# Altium schematic sheet Main_Board.SchDoc
size A2
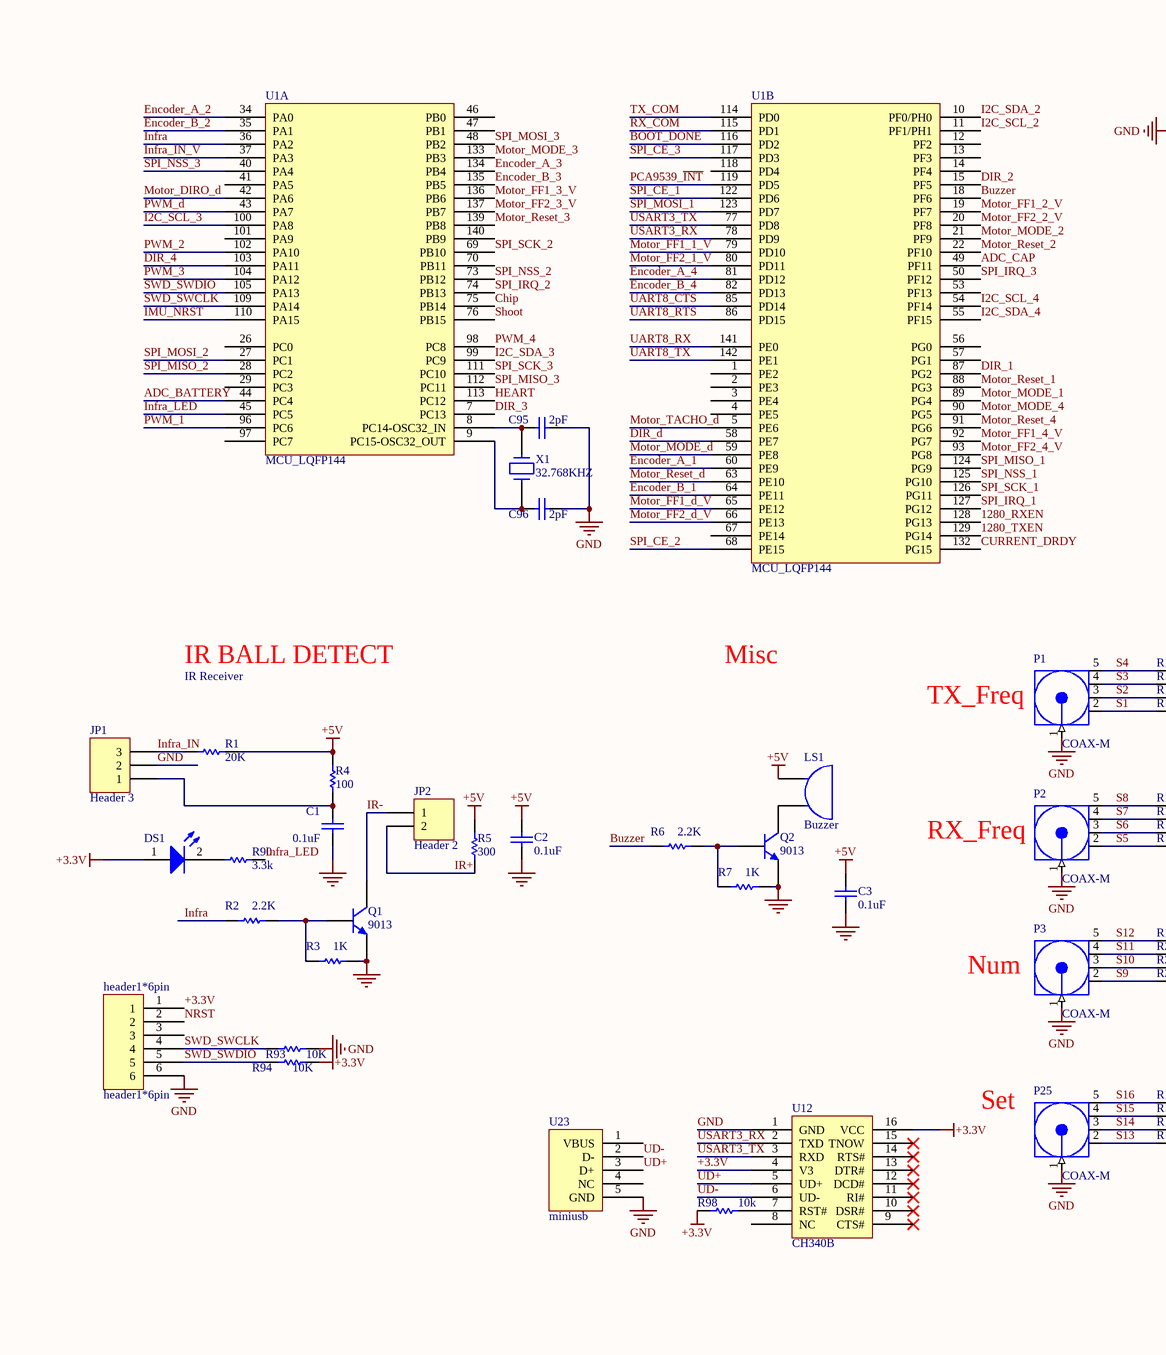
[diagram p0: Main_Board.SchDoc, left]
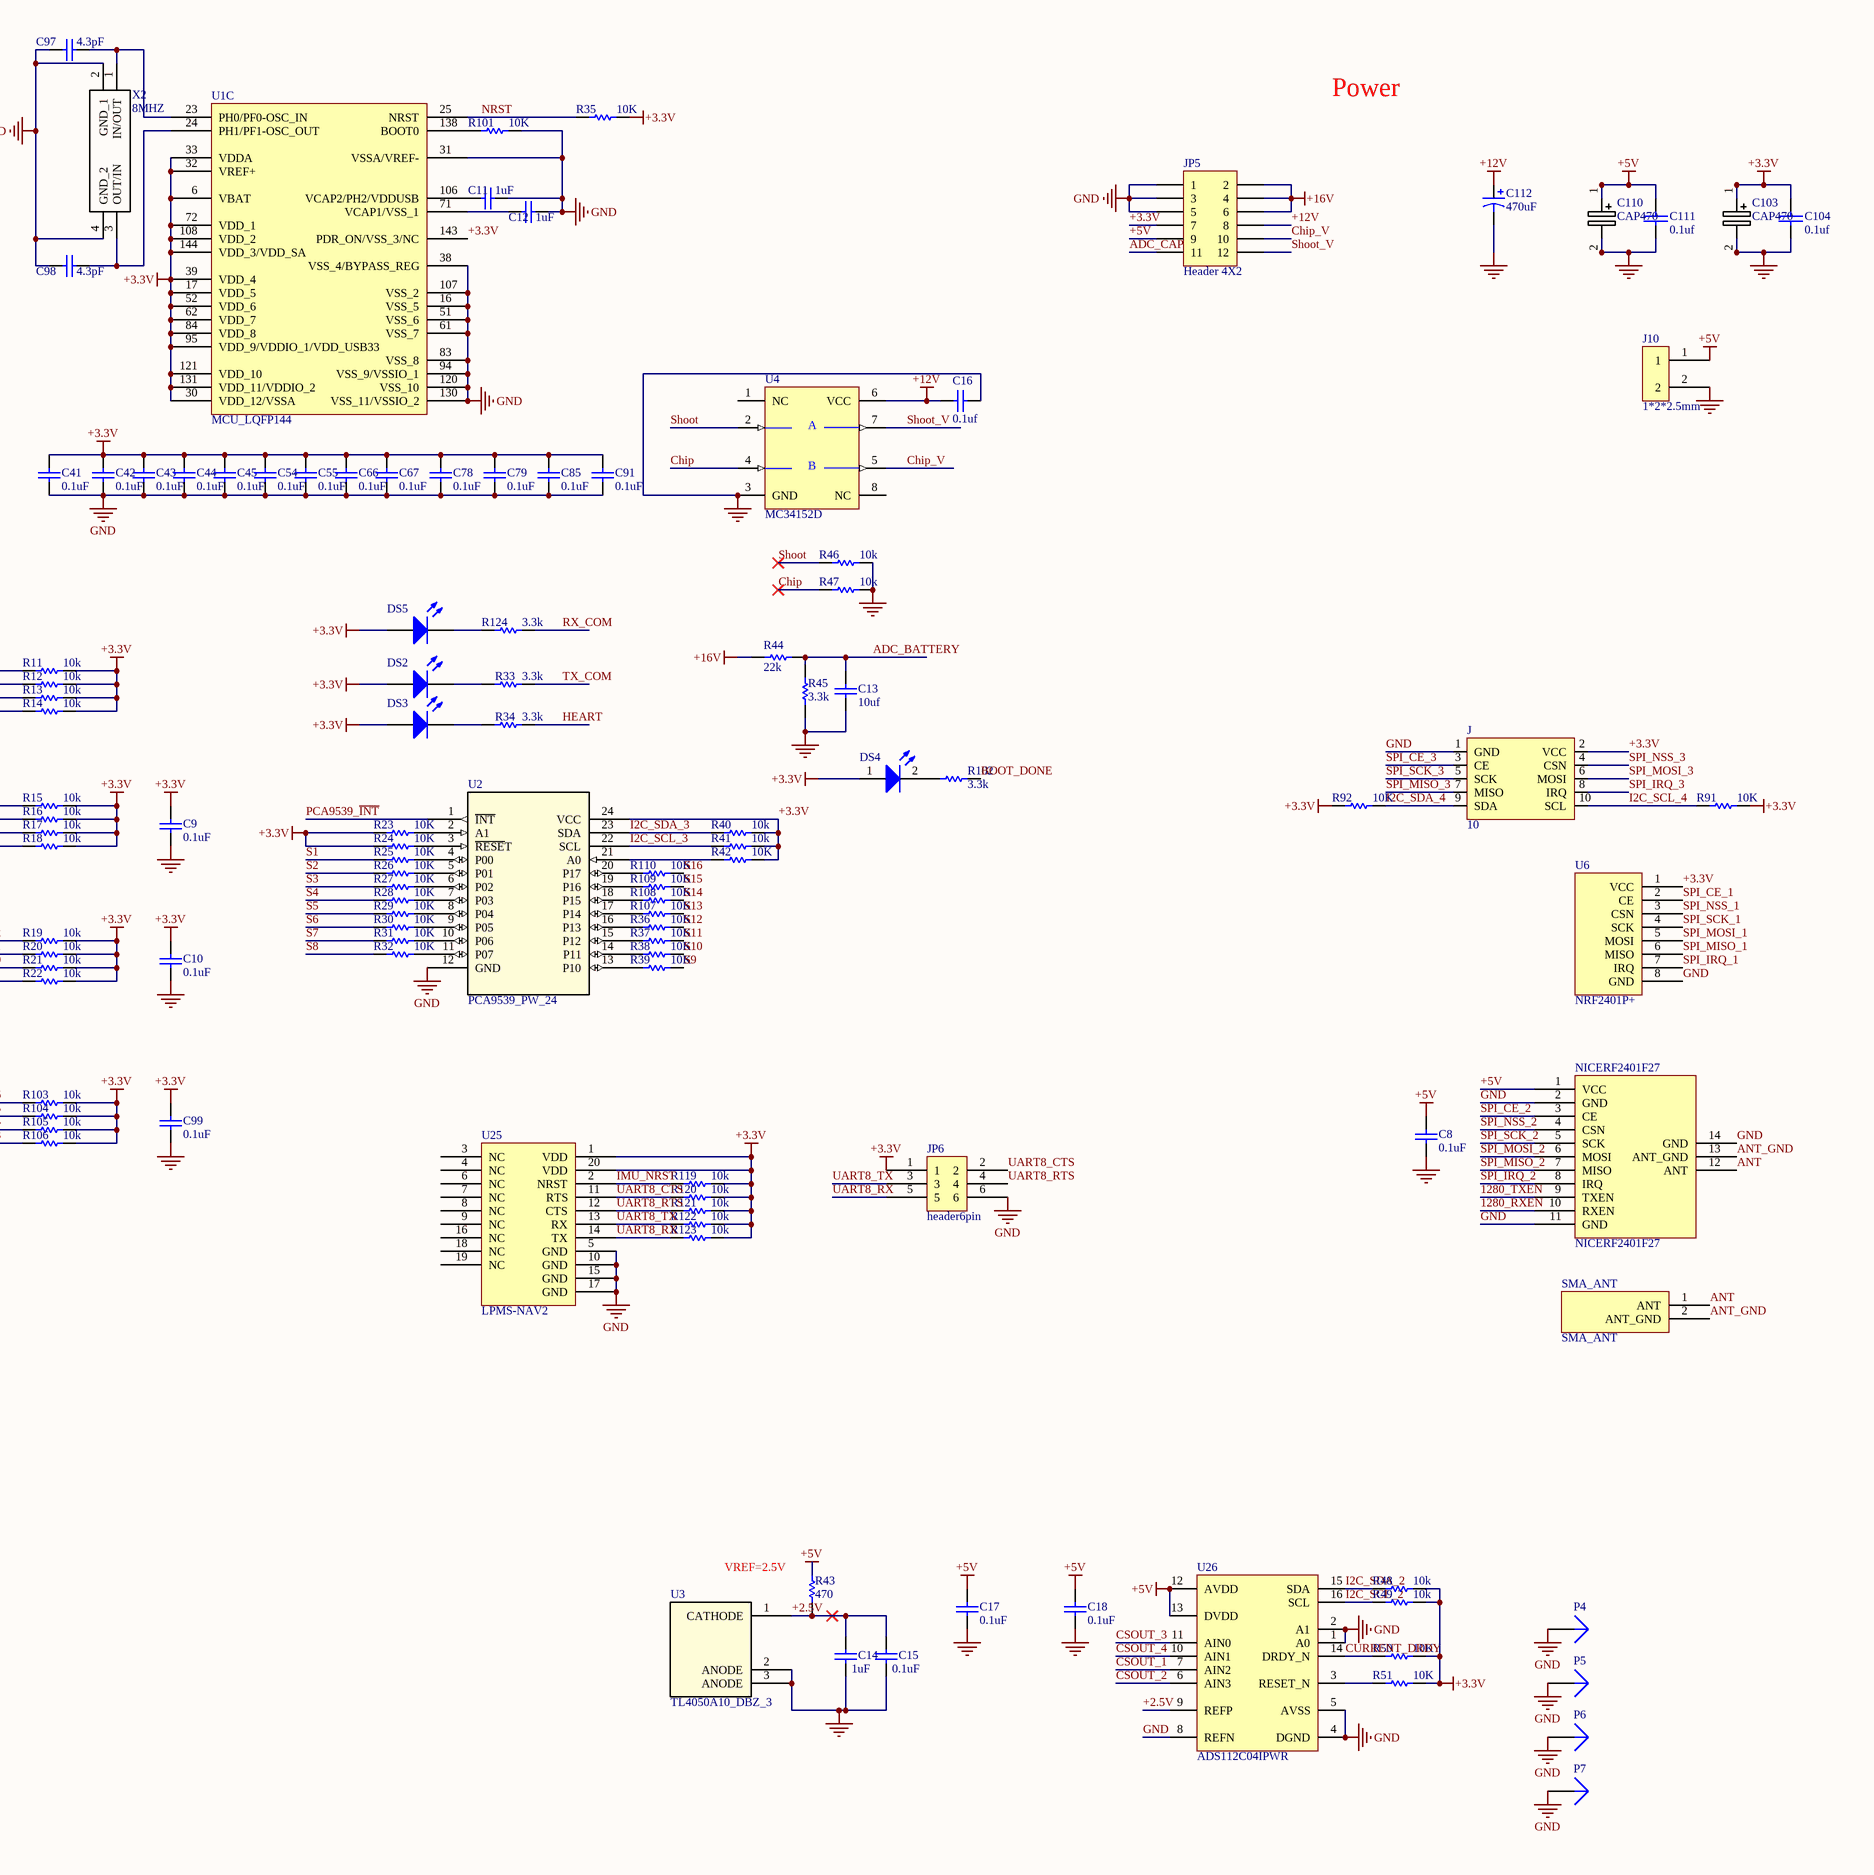
[diagram p1: Main_Board.SchDoc, right]

## Parts
C1  0.1uf  [0805C]
C2  0.1uf  [0805C]
C3  0.1uf  [0805C]
C8  0.1uF  [0805C]
C9  0.1uf  [0805C]
C10  0.1uf  [0805C]
C11  1uf  [0805C]
C12  1uf  [0805C]
C13  10uf  [0805C]
C14  1uf  [0805C]
C15  0.1uf  [0805C]
C16  0.1uf  [0805C]
C17  0.1uf  [0805C]
C18  0.1uf  [0805C]
C41  0.1uF  [0805C]
C42  0.1uf  [0805C]
C43  0.1uf  [0805C]
C44  0.1uf  [0805C]
C45  0.1uf  [0805C]
C54  0.1uf  [0805C]
C55  0.1uf  [0805C]
C66  0.1uf  [0805C]
C67  0.1uf  [0805C]
C78  0.1uf  [0805C]
C79  0.1uf  [0805C]
C85  0.1uf  [0805C]
C91  0.1uf  [0805C]
C95  2pf  [0805C]
C96  2pf  [0805C]
C97  4.3pf  [0805C]
C98  4.3pf  [0805C]
C99  0.1uF  [0805C]
C103  CAP470  [CAPPM7360X200N]
C104  0.1uf  [0805C]
C110  CAP470  [CAPPM7360X200N]
C111  0.1uf  [0805C]
C112  470uF  [470uF]
DS1  LED2  [0805D]  (value not drawn)
DS2  LED1  [0805D]  (value not drawn)
DS3  LED2  [0805D]  (value not drawn)
DS4  LED2  [0805D]  (value not drawn)
DS5  LED1  [0805D]  (value not drawn)
header1*6pin  header1*6pin  [1*6_2.5mm]
J  10  [10]
J10  1*2*2.5mm  [1*2_2.5mm]
JP1  Header 3  [SHDR3]
JP2  Header 2  [SHDR2]
JP5  Header 4X2  [2*6_2.5mm]
JP6  header6pin  [2*3_2.5mm]
LS1  Buzzer  [Buzzer]
NICERF2401F27  NICERF2401F27  [NICERF2401F27]
P1  COAX-M  [A6RV-161RS]
P2  COAX-M  [A6RV-161RS]
P3  COAX-M  [A6RV-161RS]
P4  安装孔  [安装孔-3.5-5]  (value not drawn)
P5  安装孔  [安装孔-3.5-5]  (value not drawn)
P6  安装孔  [安装孔-3.5-5]  (value not drawn)
P7  安装孔  [安装孔-3.5-5]  (value not drawn)
P25  COAX-M  [A6RV-161RS]
Q1  9013  [SO-G3/Y1]
Q2  9013  [SO-G3/Y1]
R1  20k  [0805R]
R2  2.2k  [0805R]
R3  1k  [0805R]
R4  100  [0805R]
R5  300  [0805R]
R6  2.2k  [0805R]
R7  1k  [0805R]
R11  10k  [0805R]
R12  10k  [0805R]
R13  10k  [0805R]
R14  10k  [0805R]
R15  10k  [0805R]
R16  10k  [0805R]
R17  10k  [0805R]
R18  10k  [0805R]
R19  10k  [0805R]
R20  10k  [0805R]
R21  10k  [0805R]
R22  10k  [0805R]
R23  10k  [0805R]
R24  10k  [0805R]
R25  10k  [0805R]
R26  10k  [0805R]
R27  10k  [0805R]
R28  10k  [0805R]
R29  10k  [0805R]
R30  10k  [0805R]
R31  10k  [0805R]
R32  10k  [0805R]
R33  3.3k  [0805R]
R34  3.3k  [0805R]
R35  10k  [0805R]
R36  10k  [0805R]
R37  10k  [0805R]
R38  10k  [0805R]
R39  10k  [0805R]
R40  10k  [0805R]
R41  10k  [0805R]
R42  10k  [0805R]
R43  470  [0805R]
R44  22k  [0805R]
R45  3.3k  [0805R]
R46  10k  [0805R]
R47  10k  [0805R]
R48  10k  [0805R]
R49  10k  [0805R]
R50  10k  [0805R]
R51  10k  [0805R]
R90  3.3k  [0805R]
R91  10k  [0805R]
R92  10k  [0805R]
R93  10k  [0805R]
R94  10k  [0805R]
R98  10k  [0805R]
R101  10k  [0805R]
R102  3.3k  [0805R]
R103  10k  [0805R]
R104  10k  [0805R]
R105  10k  [0805R]
R106  10k  [0805R]
R107  10k  [0805R]
R108  10k  [0805R]
R109  10k  [0805R]
R110  10k  [0805R]
R119  10k  [0805R]
R120  10k  [0805R]
R121  10k  [0805R]
R122  10k  [0805R]
R123  10k  [0805R]
R124  3.3k  [0805R]
SMA_ANT  SMA_ANT  [SMA_ANT]
U1  MCU_LQFP144  [LQFP144_0R5_SKT]  (parts A,B,C of 3)
U2  PCA9539_PW_24  [PW24-L_pca9539]
U3  TL4050A10_DBZ_3  [DBZ3-L]
U4  MC34152D  [SO-G8]
U6  NRF2401P+  [NRF2401P+_zeyao]
U12  CH340B  [SOP16]
U23  miniusb  [miniusb 180]
U25  LPMS-NAV2  [LPMS-NAV2]
U26  ADS112C04IPWR  [TSSOP_PW0016A_ADS112C04]
X1  32.768KHZ  [FC-255]
X2  8MHZ  [5032]

## Nets
+3.3V: C9.2 C10.2 C41.1 C42.1 C43.1 C44.1 C45.1 C54.1 C55.1 C66.1 C67.1 C78.1 C79.1 C85.1 C91.1 C99.2 C103.1(+) C104.1 DS1.1(A) DS2.1(A) DS3.1(A) DS4.1(A) DS5.1(A) header1*6pin.1 J.2(VCC) JP5.7 JP6.1 R11.2 R12.2 R13.2 R14.2 R15.2 R16.2 R17.2 R18.2 R19.2 R20.2 R21.2 R22.2 R23.1 R24.1 R35.2 R40.2 R41.2 R42.2 R48.2 R49.2 R50.2 R51.2 R91.2 R92.1 R93.1 R98.1 R103.2 R104.2 R105.2 R106.2 R119.2 R120.2 R121.2 R122.2 R123.2 U1.6(VBAT) U1.17(VDD_5) U1.30(VDD_12/VSSA) U1.32(VREF+) U1.33(VDDA) U1.39(VDD_4) U1.52(VDD_6) U1.62(VDD_7) U1.72(VDD_1) U1.84(VDD_8) U1.95(VDD_9/VDDIO_1/VDD_USB33) U1.108(VDD_2) U1.121(VDD_10) U1.131(VDD_11/VDDIO_2) U1.143(PDR_ON/VSS_3/NC) U1.144(VDD_3/VDD_SA) U2.24(VCC) U6.1(VCC) U12.4(V3) U12.16(VCC) U25.1(VDD) U25.20(VDD)
+5V: C2.2 C3.2 C8.1 C17.2 C18.2 C110.1(+) C111.1 J10.1 JP5.9 LS1.1(A) NICERF2401F27.1(VCC) R1.1 R4.2 R5.2 R43.2 U26.12(AVDD) U26.13(DVDD)
+12V: C16.1 C112.1 JP5.8 U4.6(VCC)
+16V: JP5.2 JP5.4 JP5.6 R44.2
GND: C1.2 C2.1 C3.1 C8.2 C9.1 C10.1 C11.1 C12.1 C13.1 C14.1 C15.1 C16.2 C17.1 C18.1 C41.2 C42.2 C43.2 C44.2 C45.2 C54.2 C55.2 C66.2 C67.2 C78.2 C79.2 C85.2 C91.2 C95.2 C96.2 C97.2 C98.2 C99.1 C103.2(-) C104.2 C110.2(-) C111.2 C112.2 header1*6pin.6 J.1(GND) J10.2 JP1.2 JP5.1 JP5.3 JP5.5 JP6.6 NICERF2401F27.2(GND) NICERF2401F27.11(GND) NICERF2401F27.14(GND) P1.1(Signal) P2.1(Signal) P3.1(Signal) P4.1 P5.1 P6.1 P7.1 P25.1(Signal) Q1.2(E) Q2.2(E) R3.2 R7.2 R45.1 R46.1 R47.1 R94.1 R101.2 U1.16(VSS_5) U1.31(VSSA/VREF-) U1.38(VSS_4/BYPASS_REG) U1.51(VSS_6) U1.61(VSS_7) U1.83(VSS_8) U1.94(VSS_9/VSSIO_1) U1.107(VSS_2) U1.120(VSS_10) U1.130(VSS_11/VSSIO_2) U2.12(GND) U3.2(ANODE) U3.3(ANODE) U4.3(GND) U6.8(GND) U12.1(GND) U23.5(GND) U25.5(GND) U25.10(GND) U25.15(GND) U25.17(GND) U26.1(A0) U26.2(A1) U26.4(DGND) U26.5(AVSS) U26.8(REFN) X2.2(GND_1) X2.4(GND_2)
1280_RXEN: NICERF2401F27.10(RXEN) U1.128(PG13)
1280_TXEN: NICERF2401F27.9(TXEN) U1.129(PG14)
+2.5V: C14.2 C15.2 R43.1 U3.1(CATHODE) U26.9(REFP)
ADC_BATTERY: C13.2 R44.1 R45.2 U1.44(PC4)
ADC_CAP: JP5.11 U1.49(PF11)
ANT: NICERF2401F27.12(ANT) SMA_ANT.1(ANT)
ANT_GND: NICERF2401F27.13(ANT_GND) SMA_ANT.2(ANT_GND)
BOOT_DONE: R102.1 U1.116(PD2)
Buzzer: R6.1 U1.18(PF6)
Chip: R47.2 U1.75(PB14) U4.4(INB)
Chip_V: JP5.10 U4.5(~{OUTB})
CSOUT_1: U26.7(AIN2)
CSOUT_2: U26.6(AIN3)
CSOUT_3: U26.11(AIN0)
CSOUT_4: U26.10(AIN1)
CURRENT_DRDY: R50.1 U1.132(PG15) U26.14(DRDY_N)
DIR_1: U1.87(PG2)
DIR_2: U1.15(PF5)
DIR_3: U1.7(PC13)
DIR_4: U1.103(PA11)
DIR_d: U1.58(PE7)
Encoder_A_1: U1.60(PE9)
Encoder_A_2: U1.34(PA0)
Encoder_A_3: U1.134(PB4)
Encoder_A_4: U1.81(PD12)
Encoder_B_1: U1.64(PE11)
Encoder_B_2: U1.35(PA1)
Encoder_B_3: U1.135(PB5)
Encoder_B_4: U1.82(PD13)
HEART: R34.1 U1.113(PC12)
I2C_SCL_2: R49.1 U1.11(PF1/PH1) U26.16(SCL)
I2C_SCL_3: R41.1 U1.100(PA8) U2.22(SCL)
I2C_SCL_4: J.10(SCL) R91.1 U1.54(PF14)
I2C_SDA_2: R48.1 U1.10(PF0/PH0) U26.15(SDA)
I2C_SDA_3: R40.1 U1.99(PC9) U2.23(SDA)
I2C_SDA_4: J.9(SDA) R92.2 U1.55(PF15)
IMU_NRST: R119.1 U1.110(PA15) U25.2(NRST)
Infra: R2.1 U1.36(PA2)
Infra_IN: JP1.3 R1.2
Infra_IN_V: U1.37(PA3)
Infra_LED: R90.1 U1.45(PC5)
IR+: JP2.1(2) R5.1
IR-: JP2.2(1) Q1.3(C)
Motor_DIRO_d: U1.42(PA6)
Motor_FF1_1_V: U1.79(PD10)
Motor_FF1_2_V: U1.19(PF7)
Motor_FF1_3_V: U1.136(PB6)
Motor_FF1_4_V: U1.92(PG7)
Motor_FF1_d_V: U1.65(PE12)
Motor_FF2_1_V: U1.80(PD11)
Motor_FF2_2_V: U1.20(PF8)
Motor_FF2_3_V: U1.137(PB7)
Motor_FF2_4_V: U1.93(PG8)
Motor_FF2_d_V: U1.66(PE13)
Motor_MODE_1: U1.89(PG4)
Motor_MODE_2: U1.21(PF9)
Motor_MODE_3: U1.133(PB3)
Motor_MODE_4: U1.90(PG5)
Motor_MODE_d: U1.59(PE8)
Motor_Reset_1: U1.88(PG3)
Motor_Reset_2: U1.22(PF10)
Motor_Reset_3: U1.139(PB8)
Motor_Reset_4: U1.91(PG6)
Motor_Reset_d: U1.63(PE10)
Motor_TACHO_d: U1.5(PE6)
NRST: header1*6pin.2 R35.1 U1.25(NRST)
PCA9539_~{INT}: U1.119(PD5) U2.1(~{INT})
PWM_1: U1.96(PC6)
PWM_2: U1.102(PA10)
PWM_3: U1.104(PA12)
PWM_4: U1.98(PC8)
PWM_d: U1.43(PA7)
RX_COM: R124.1 U1.115(PD1)
S1: P1.2(GND) R14.1 R25.1
S2: P1.3(GND) R13.1 R26.1
S3: P1.4(GND) R12.1 R27.1
S4: P1.5(GND) R11.1 R28.1
S5: P2.2(GND) R18.1 R29.1
S6: P2.3(GND) R17.1 R30.1
S7: P2.4(GND) R16.1 R31.1
S8: P2.5(GND) R15.1 R32.1
S9: P3.2(GND) R22.1 R39.2
S10: P3.3(GND) R21.1 R38.2
S11: P3.4(GND) R20.1 R37.2
S12: P3.5(GND) R19.1 R36.2
S13: P25.2(GND) R106.1 R107.2
S14: P25.3(GND) R105.1 R108.2
S15: P25.4(GND) R104.1 R109.2
S16: P25.5(GND) R103.1 R110.2
Shoot: R46.2 U1.76(PB15) U4.2(INA)
Shoot_V: JP5.12 U4.7(~{OUTA})
SPI_CE_1: U1.122(PD6) U6.2(CE)
SPI_CE_2: NICERF2401F27.3(CE) U1.68(PE15)
SPI_CE_3: J.3(CE) U1.117(PD3)
SPI_IRQ_1: U1.127(PG12) U6.7(IRQ)
SPI_IRQ_2: NICERF2401F27.8(IRQ) U1.74(PB13)
SPI_IRQ_3: J.8(IRQ) U1.50(PF12)
SPI_MISO_1: U1.124(PG9) U6.6(MISO)
SPI_MISO_2: NICERF2401F27.7(MISO) U1.28(PC2)
SPI_MISO_3: J.7(MISO) U1.112(PC11)
SPI_MOSI_1: U1.123(PD7) U6.5(MOSI)
SPI_MOSI_2: NICERF2401F27.6(MOSI) U1.27(PC1)
SPI_MOSI_3: J.6(MOSI) U1.48(PB2)
SPI_NSS_1: U1.125(PG10) U6.3(CSN)
SPI_NSS_2: NICERF2401F27.4(CSN) U1.73(PB12)
SPI_NSS_3: J.4(CSN) U1.40(PA4)
SPI_SCK_1: U1.126(PG11) U6.4(SCK)
SPI_SCK_2: NICERF2401F27.5(SCK) U1.69(PB10)
SPI_SCK_3: J.5(SCK) U1.111(PC10)
SWD_SWCLK: header1*6pin.4 R94.2 U1.109(PA14)
SWD_SWDIO: header1*6pin.5 R93.2 U1.105(PA13)
TX_COM: R33.1 U1.114(PD0)
UART8_CTS: JP6.2 R120.1 U1.85(PD14) U25.11(RTS)
UART8_RTS: JP6.4 R121.1 U1.86(PD15) U25.12(CTS)
UART8_RX: JP6.5 R123.1 U1.141(PE0) U25.14(TX)
UART8_TX: JP6.3 R122.1 U1.142(PE1) U25.13(RX)
UD+: U12.5(UD+) U23.3(D+)
UD-: U12.6(UD-) U23.2(D-)
USART3_RX: U1.78(PD9) U12.2(TXD)
USART3_TX: U1.77(PD8) U12.3(RXD)
NetC1_1: C1.1 JP1.1 R4.1
NetC11_2: C11.2 U1.106(VCAP2/PH2/VDDUSB)
NetC12_2: C12.2 U1.71(VCAP1/VSS_1)
NetC95_1: C95.1 U1.8(PC14-OSC32_IN) X1.2
NetC96_1: C96.1 U1.9(PC15-OSC32_OUT) X1.1
NetC97_1: C97.1 U1.23(PH0/PF0-OSC_IN) X2.1(IN/OUT)
NetC98_1: C98.1 U1.24(PH1/PF1-OSC_OUT) X2.3(OUT/IN)
NetDS1_2: DS1.2(K) R90.2
NetDS2_2: DS2.2(K) R33.2
NetDS3_2: DS3.2(K) R34.2
NetDS4_2: DS4.2(K) R102.2
NetDS5_2: DS5.2(K) R124.2
NetLS1_2: LS1.2(B) Q2.3(C)
NetQ1_1: Q1.1(B) R2.2 R3.1
NetQ2_1: Q2.1(B) R6.2 R7.1
NetR23_2: R23.2 U2.2(A1)
NetR24_2: R24.2 U2.3(~{RESE}T)
NetR25_2: R25.2 U2.4(P00)
NetR26_2: R26.2 U2.5(P01)
NetR27_2: R27.2 U2.6(P02)
NetR28_2: R28.2 U2.7(P03)
NetR29_2: R29.2 U2.8(P04)
NetR30_2: R30.2 U2.9(P05)
NetR31_2: R31.2 U2.10(P06)
NetR32_2: R32.2 U2.11(P07)
NetR36_1: R36.1 U2.16(P13)
NetR37_1: R37.1 U2.15(P12)
NetR38_1: R38.1 U2.14(P11)
NetR39_1: R39.1 U2.13(P10)
NetR42_1: R42.1 U2.21(A0)
NetR51_1: R51.1 U26.3(RESET_N)
NetR98_2: R98.2 U12.7(RST#)
NetR101_1: R101.1 U1.138(BOOT0)
NetR107_1: R107.1 U2.17(P14)
NetR108_1: R108.1 U2.18(P15)
NetR109_1: R109.1 U2.19(P16)
NetR110_1: R110.1 U2.20(P17)

Not connected (* = marked no-connect by the designer): header1*6pin 3; U1 1(PE2) 2(PE3) 3(PE4) 4(PE5) 12(PF2) 13(PF3) 14(PF4) 26(PC0) 29(PC3) 41(PA5) 46(PB0) 47(PB1) 53(PF13) 56(PG0) 57(PG1) 67(PE14) 70(PB11) 97(PC7) 101(PA9) 118(PD4) 140(PB9); U4 1(NC) 8(NC); U12 8(NC) 9(CTS#)* 10(DSR#)* 11(RI#)* 12(DCD#)* 13(DTR#)* 14(RTS#)* 15(TNOW)*; U23 1(VBUS) 4(NC); U25 3(NC) 4(NC) 6(NC) 7(NC) 8(NC) 9(NC) 16(NC) 18(NC) 19(NC)

## Notes on the sheet
- Power
- IR Receiver
- IR BALL DETECT
- Misc
- (near P1) TX_Freq
- (near P2) RX_Freq
- Num
- (near P25) Set
- VREF=2.5V
- (in symbol MC34152D) A; B

## Library data of the parts
C1-C3 C8-C13 C16 C41-C45 C54 C55 C66 C67 C78 C79 C85 C91 C95-C99 = Cap: Capacitor; Published: 8-Jun-2000; LatestRevisionDate: 17-Jul-2002; LatestRevisionNote: Re-released for DXP Platform.; Publisher: Altium Limited
  C1-C3 C8-C10 C41-C45 C54 C55 C66 C67 C78 C79 C85 C91 C99: Value: 0.1uF
  C11 C12: Value: 1uF
  C95 C96: Value: 2pF
  C97 C98: Value: 4.3pF
C14 C15 C17 C18 = Cap: Capacitor; Manufacturer: Generic Components; Class: Passive; Published: 08/06/2000; Publisher: Altium Hobart Technology Centre; SubClass: Capacitor
  C14: Value: 1uF
  C15 C17 C18: Value: 0.1uF
C103 C110 = T523H477M016APE0707280: 470uF电容贴片; Manufacturer_Name: Kemet; Datasheet Link: https://api.kemet.com/component-edge/download/datasheet/T523H477M016APE0707280.pdf; Height: 2mm; Manufacturer_Part_Number: T523H477M016APE0707280; Mouser Part Number: 80-T523H477M16P070LR; Mouser Price/Stock: https://www.mouser.com/Search/Refine.aspx?Keyword=80-T523H477M16P070LR
C104 C111 = CAP: Capacitor
C112 = Cap Pol1: Polarized Capacitor (Radial); Published: 8-Jun-2000; LatestRevisionDate: 17-Jul-2002; LatestRevisionNote: Re-released for DXP Platform.; PackageReference: RB7.6-15; Publisher: Altium Limited; PackageDescription: Polarized Capacitor (Radial); 2 Leads
DS1 DS4 = LED2: Typical RED, GREEN, YELLOW, AMBER GaAs LED; Manufacturer: Generic Components; Class: Optoelectronic; Published: 08/06/2000; Publisher: Altium Hobart Technology Centre; SubClass: LED
DS2 DS5 = LED1: Typical RED, GREEN, YELLOW, AMBER GaAs LED; Published: 8-Jun-2000; LatestRevisionDate: 17-Jul-2002; LatestRevisionNote: Re-released for DXP Platform.; Publisher: Altium Limited
DS3 = LED2: Typical RED, GREEN, YELLOW, AMBER GaAs LED; Published: 8-Jun-2000; LatestRevisionDate: 17-Jul-2002; LatestRevisionNote: Re-released for DXP Platform.; Publisher: Altium Limited
JP1 = Header 3: Header, 3-Pin; LatestRevisionDate: 17-Jul-2002; LatestRevisionNote: Re-released for DXP Platform.; Publisher: Altium Limited
JP2 = Header 2: Header, 2-Pin; LatestRevisionDate: 17-Jul-2002; LatestRevisionNote: Re-released for DXP Platform.; Publisher: Altium Limited
JP5 = Header 6X2: Header, 4-Pin, Dual row; LatestRevisionDate: 17-Jul-2002; LatestRevisionNote: Re-released for DXP Platform.; Publisher: Altium Limited
LS1 = Buzzer: Manufacturer: Generic Components; Published: 1999
P1-P3 P25 = COAX-M: RF Coaxial PCB Connector, MMCX; Thru-Hole, Vertical Mount Plug,  50 Ohm Impedance; PackageDocument: Rev. A, 16-Jun-1997; PCB_Layout: Complies with manufacturer's recommendation.; DrillSize: Corresponds to nominal value.; Published: 15-Jul-2004; LatestRevisionDate: 15-Jul-2004; LatestRevisionNote: Component Replaced.; DatasheetDocument: 30-May-2003; PackageReference: 908-21103; Publisher: Altium Limited; ComponentLink1Description: Manufacturer Link; ComponentLink1URL: http://www.amphenolrf.com/
P4-P7 = Plug: LatestRevisionDate: 17-Jul-2002; LatestRevisionNote: Re-released for DXP Platform.; Publisher: Altium Limited
Q1 Q2 = BC817-40: NPN General Purpose Amplifier; Manufacturer: Fairchild Semiconductor; Revised: 11-July-2000: SIM Model Added.; Class: Discrete; SubClass: BJT - Low Power; Published: 8/06/2000; Publisher: Altium Hobart Technology Centre
R1-R7 R11-R45 R48-R51 R90-R94 R98 R101-R110 R119-R124 = Res1: Resistor; Manufacturer: Generic Components; Class: Passive; Published: 08/06/2000; Publisher: Altium Hobart Technology Centre; SubClass: Resistor
  R1: Value: 20K
  R2 R6: Value: 2.2K
  R3 R7: Value: 1K
  R4: Value: 100
  R5: Value: 300
  R11-R22 R40 R41 R48 R49 R98 R103-R106 R119-R123: Value: 10k
  R23-R32 R35-R39 R42 R50 R51 R91-R94 R101 R107-R110: Value: 10K
  R33 R34 R45 R90 R102 R124: Value: 3.3k
  R43: Value: 470
  R44: Value: 22k
R46 R47 = SR0805: Resistance; VALUE: 10k
U2 = PCA9539_PW_24: Remote 16-Bit I2C And SMBus, Low-Power I/O Expander With Interrupt Output, Reset & Config. Registers; Vendor: Texas Instruments; PACKAGE_DESIGNATOR: PW; PIN_COUNT: 24; FAMILY_NAME: I2C IO EXPANDER; INDUSTRY_STD_PKG_TYPE: TSSOP; Manufacturer_Part_Number: pca9539_pw_24; GENERIC_PART_NUMBER: PCA9539; Datasheet_URL: http://www.ti.com/lit/gpn/PCA9539; Manufacturer: Texas Instruments; RefDes: RefDes; Type: DEV; Value: Value
U3 = TL4050A10_DBZ_3: Precision Micropower Shunt Voltage Reference; Vendor: Texas Instruments; PACKAGE_DESIGNATOR: DBZ; PIN_COUNT: 3; INDUSTRY_STD_PKG_TYPE: SOT-23; Manufacturer_Part_Number: tl4050a10_dbz_3; GENERIC_PART_NUMBER: TL4050A10; FAMILY_NAME: SHUNT VOLTAGE REFERENCE; Datasheet_URL: http://www.ti.com/lit/gpn/TL4050A10; Manufacturer: Texas Instruments; RefDes: RefDes; Type: DEV; Value: Value
U4 = MC34152D: High Speed Dual MOSFET Driver; Manufacturer: Motorola; Class: Interface; Published: 15/04/2002; Publisher: Altium Hobart Technology Centre; SubClass: MOSFET Driver
U26 = ADS112C04IPWR: Imported; Manufacturer: Texas Instruments; PartNumber: ADS112C04IPWR; RefDes: RefDes; Type: DEV; Value: Value
X1 = CRYSTAL
X2 = ECS-80-18-30B-AGN-TR: Crystal or Oscillator; Manufacturer_Name: ECS; Datasheet Link: http://www.ecsxtal.com/store/pdf/ecx_53b.pdf; Height: 0.85mm; Manufacturer_Part_Number: ECS-80-18-30B-AGN-TR; Mouser Part Number: 520-80-18-30B-AGNT; Mouser Price/Stock: https://www.mouser.com/Search/Refine.aspx?Keyword=520-80-18-30B-AGNT